# EAGLE design RJ-45 Jack Breakout (EAGLE 9.5.2)
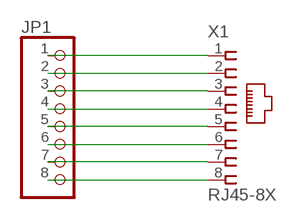
[diagram p0: schematic, sheet 1]

## Parts
JP1  PINHD-1X8  [1X08]
X1  RJ45-8X  [RJ45-NO-SHIELD]

## Nets
N$1: JP1.1 X1.1
N$2: JP1.2 X1.2
N$3: JP1.3 X1.3
N$4: JP1.4 X1.4
N$5: JP1.5 X1.5
N$6: JP1.6 X1.6
N$7: JP1.7 X1.7
N$8: JP1.8 X1.8

## Library data of the parts
JP1 = pinhead:PINHD-1X8: PIN HEADER
X1 = Box Header:RJ45: CORCOM Modular RJ Jacks No Shield Source: www.tycoelectronics.com .. ENG_DS_1654001_1099_RJ_L_0507.pdf; MPN: RJ45-8X; OC_FARNELL: unknown; OC_NEWARK: 16R6101

## Board
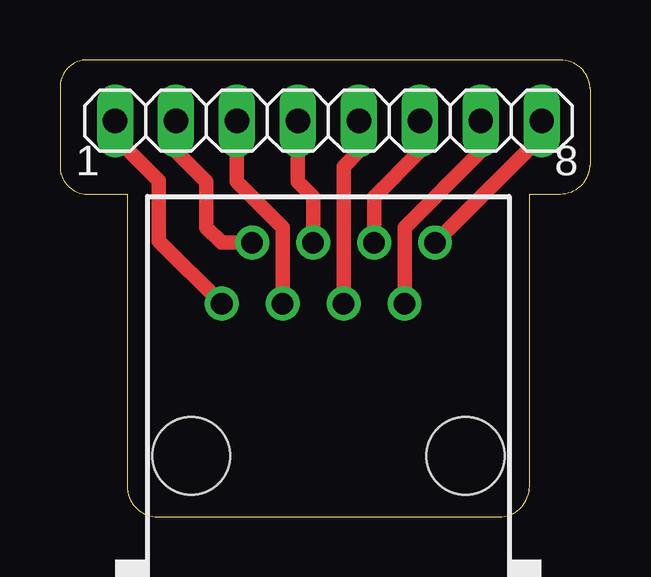
[diagram p1: board, top side]

Size 22.1 x 19.05 mm. Coordinates in mm from the lower left corner, seen from the top.
Outline: 2.8,13.46 2.8,1.27 arc90 4.07,0 18.29,0 arc90 19.56,1.27 19.56,13.46 20.83,13.46 arc90 22.1,14.73 22.1,17.78 arc90 20.83,19.05 1.02,19.05 arc90 0.01,17.78 0.01,14.73 arc90 1.02,13.46 2.8,13.46
Copper layers (1*16): Top 0.035mm / dielectric 1.5mm / Bottom 0.035mm
Design rules "default": minimum track width 6mil, minimum drill 0.35mm, track to track 6mil, track to pad 6mil, pad to pad 6mil, via to via 6mil, smd to smd 6mil, copper to edge 40mil, drill to drill 6mil, minimum pad ring 10mil, minimum via ring 8mil, stop-mask expansion 4mil, vias tented up to drill 0mil, thermal gap 10mil

### Footprints (pad centres in the part's own frame; a part is rotated, then mirrored left to right if it is on the bottom)
1X08 = drill 1.016 long: 1 -8.89,0; 2 -6.35,0; 3 -3.81,0; 4 -1.27,0; 5 1.27,0; 6 3.81,0; 7 6.35,0; 8 8.89,0
RJ45-NO-SHIELD = drill 0.9 pad 1.4: 1 -4.445,6.35; 2 -3.175,8.89; 3 -1.905,6.35; 4 -0.635,8.89; 5 0.635,6.35; 6 1.905,8.89; 7 3.175,6.35; 8 4.445,8.89 | hole 3.251: -5.715,0; 5.715,0

### Placement (x,y rotation side)
JP1  11.18,16.51 0 top
X1  11.18,2.54 0 top

### Tracks (layer width: path | path; a pad name or v marks a point on that pad's centre or on a via)
N$1
  Top 0.61: X1.1 4.12,11.51 4.12,14.01 2.29,15.84 JP1.1
N$2
  Top 0.61: X1.2 6.74,11.43 6.1,12.06 6.1,13.97 4.83,15.24 JP1.2
N$3
  Top 0.61: X1.3 9.28,12.06 7.37,13.97 JP1.3
N$4
  Top 0.61: X1.4 10.55,13.34 9.91,13.97 JP1.4
N$5
  Top 0.61: X1.5 11.82,14.61 12.45,15.24 JP1.5
N$6
  Top 0.61: X1.6 13.09,13.34 14.99,15.24 JP1.6
N$7
  Top 0.61: X1.7 14.36,12.06 17.53,15.24 JP1.7
N$8
  Top 0.61: X1.8 20.07,15.88 JP1.8

### Text on the board
tPlace: 1 | 8
bNames: RJ-45 Jack / Breakout v0.1